# EAGLE design test1 (EAGLE 6.6.0)
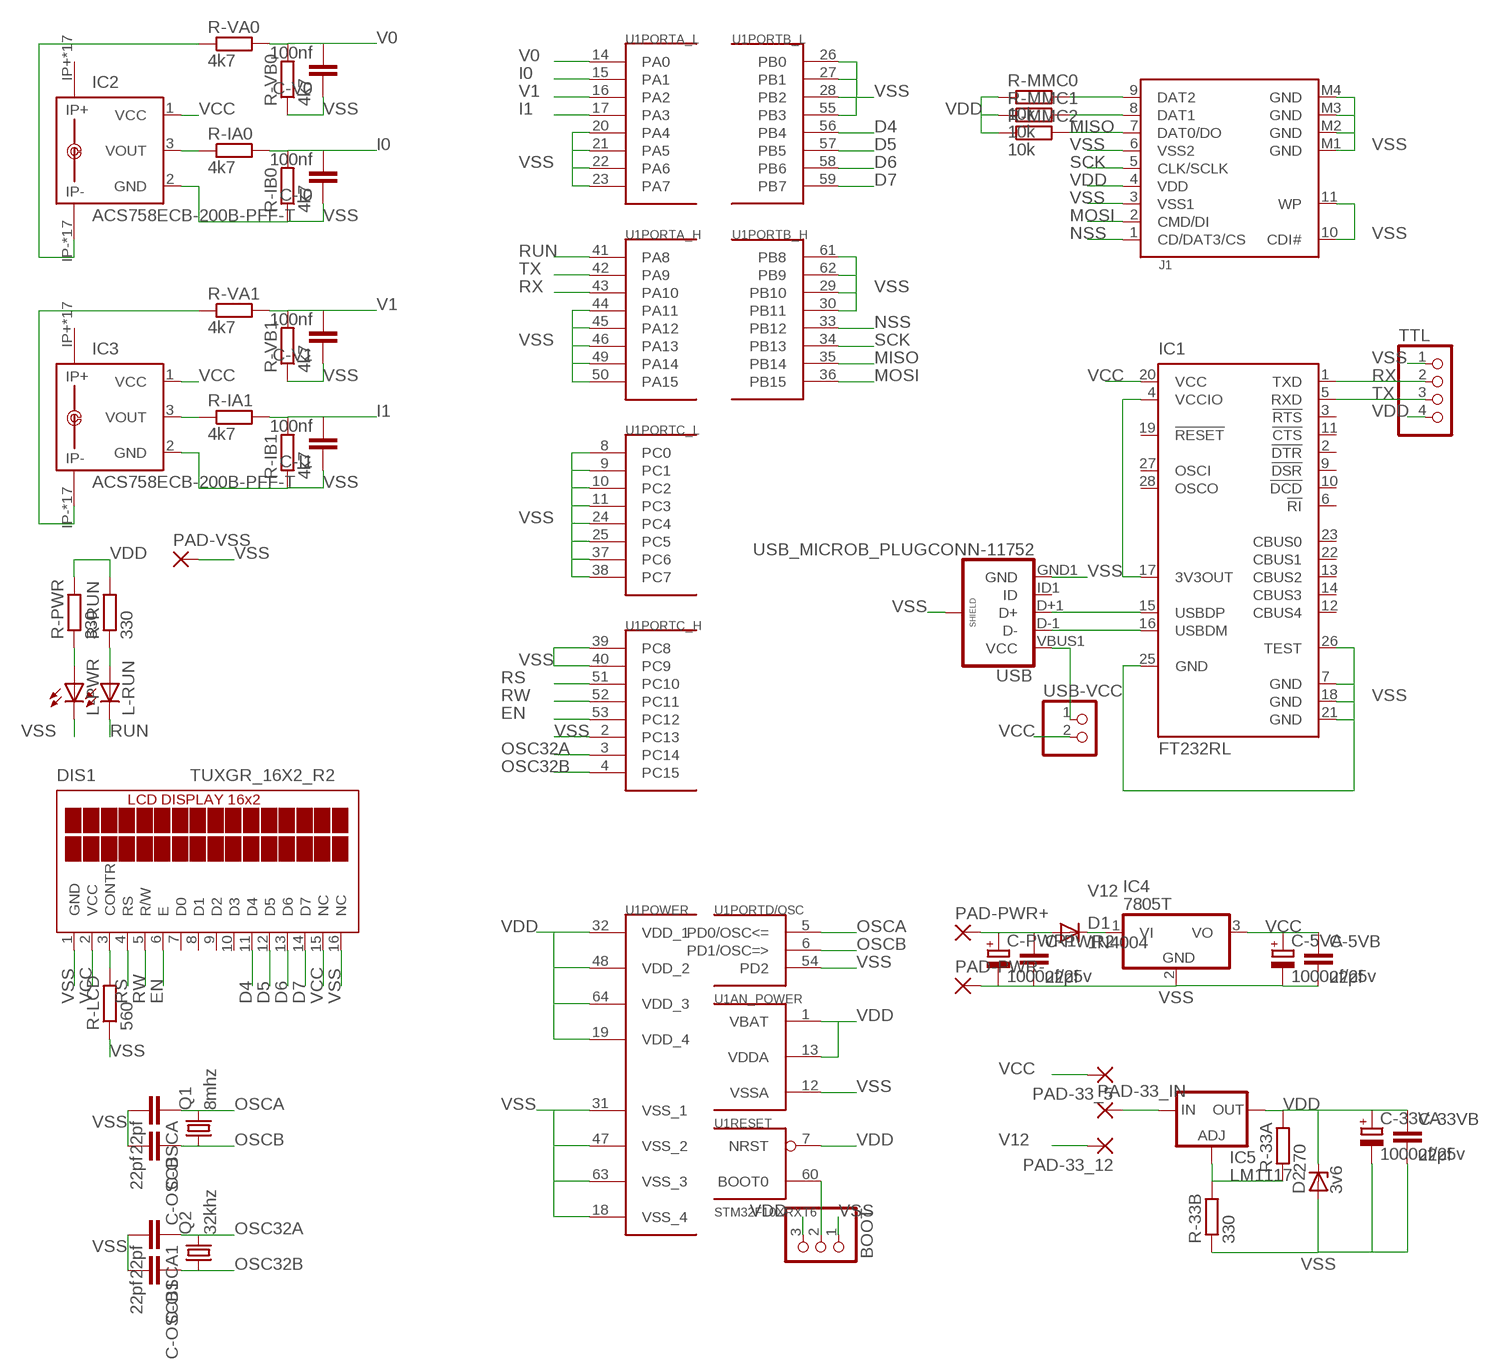
[diagram p0: schematic, sheet 1]

## Parts
BOOT  PINHD-1X3  [1X03]
C-5VA  1000uf/25v  CPOL-EUE2-5  [E2-5]
C-5VB  22pf  C-EUC1206  [C1206]
C-33VA  1000uf/25v  CPOL-EUE2-5  [E2-5]
C-33VB  22pf  C-EUC1206  [C1206]
C-I0  100nf  C-EUC1206  [C1206]
C-I1  100nf  C-EUC1206  [C1206]
C-OSCA  22pf  C-EUC1206  [C1206]
C-OSCA1  22pf  C-EUC1206  [C1206]
C-OSCB  22pf  C-EUC1206  [C1206]
C-OSCB1  22pf  C-EUC1206  [C1206]
C-PWR1  1000uf/25v  CPOL-EUE2-5  [E2-5]
C-PWR2  22pf  C-EUC1206  [C1206]
C-V0  100nf  C-EUC1206  [C1206]
C-V1  100nf  C-EUC1206  [C1206]
D1  1N4004  [DO41-10]
D2  3v6  ZENER-DIODESMB  [SMB]
DIS1  TUXGR_16X2_R2  [TUXGR_16X2_R2]
IC1  FT232RL  [SSOP28]
IC2  ACS758ECB-200B-PFF-T  [CB-PFF]
IC3  ACS758ECB-200B-PFF-T  [CB-PFF]
IC4  7805T  [TO220H]
IC5  LM1117  LM317TL  [317TL]
J1  SDCARD  [SDCMF-10915W010]
L-PWR  LEDSML1206  [SML1206]
L-RUN  LEDSML1206  [SML1206]
PAD-33_5  3,81/1,4  [3,81/1,4]
PAD-33_12  3,81/1,4  [3,81/1,4]
PAD-33_IN  3,81/1,4  [3,81/1,4]
PAD-PWR+  3,81/1,4  [3,81/1,4]
PAD-PWR-  3,81/1,4  [3,81/1,4]
PAD-VSS  3,81/1,4  [3,81/1,4]
Q1  8mhz  CRYSTALHC49S  [HC49/S]
Q2  32khz  CRYSTALTC26V  [TC26V]
R-33A  270  R-EU_R1206  [R1206]
R-33B  330  R-EU_R1206  [R1206]
R-IA0  4k7  R-EU_R1206  [R1206]
R-IA1  4k7  R-EU_R1206  [R1206]
R-IB0  4k7  R-EU_R1206  [R1206]
R-IB1  4k7  R-EU_R1206  [R1206]
R-LCD  560  R-EU_R1206  [R1206]
R-MMC0  10k  R-EU_R1206  [R1206]
R-MMC1  10k  R-EU_R1206  [R1206]
R-MMC2  10k  R-EU_R1206  [R1206]
R-PWR  330  R-EU_R1206  [R1206]
R-RUN  330  R-EU_R1206  [R1206]
R-VA0  4k7  R-EU_R1206  [R1206]
R-VA1  4k7  R-EU_R1206  [R1206]
R-VB0  4k7  R-EU_R1206  [R1206]
R-VB1  4k7  R-EU_R1206  [R1206]
TTL  PINHD-1X4  [1X04]
U1  STM32F10XRXT6  [TQFP64]
USB  USB_MICROB_PLUGCONN-11752  [USB-B-MICRO-SMD_V03]
USB-VCC  PINHD-1X2  [1X02]

## Nets
D4: DIS1.11(D4) U1.56(PORTB_L:PB4)
D5: DIS1.12(D5) U1.57(PORTB_L:PB5)
D6: DIS1.13(D6) U1.58(PORTB_L:PB6)
D7: DIS1.14(D7) U1.59(PORTB_L:PB7)
EN: DIS1.6(E) U1.53(PORTC_H:PC12)
I0: C-I0.2 R-IA0.2 R-IB0.2 U1.15(PORTA_L:PA1)
I1: C-I1.2 R-IA1.2 R-IB1.2 U1.17(PORTA_L:PA3)
MISO: J1.7(DAT0/DO) R-MMC2.2 U1.35(PORTB_H:PB14)
MOSI: J1.2(CMD/DI) U1.36(PORTB_H:PB15)
N$1: IC1.16(USBDM) USB.D-1(D-)
N$2: IC1.15(USBDP) USB.D+1(D+)
N$3: IC2.3(VOUT) R-IA0.1
N$4: IC2.IP- IC2.IP-@2(IP-) IC2.IP-@3(IP-) IC2.IP-@4(IP-) IC2.IP-@5(IP-) IC2.IP-@6(IP-) IC2.IP-@7(IP-) IC2.IP-@8(IP-) IC2.IP-@9(IP-) IC2.IP-@10(IP-) IC2.IP-@11(IP-) IC2.IP-@12(IP-) IC2.IP-@13(IP-) IC2.IP-@14(IP-) IC2.IP-@15(IP-) IC2.IP-@16(IP-) IC2.IP-@17(IP-) R-VA0.1
N$5: USB-VCC.1 USB.VBUS1(VCC)
N$6: IC3.3(VOUT) R-IA1.1
N$7: IC3.IP- IC3.IP-@2(IP-) IC3.IP-@3(IP-) IC3.IP-@4(IP-) IC3.IP-@5(IP-) IC3.IP-@6(IP-) IC3.IP-@7(IP-) IC3.IP-@8(IP-) IC3.IP-@9(IP-) IC3.IP-@10(IP-) IC3.IP-@11(IP-) IC3.IP-@12(IP-) IC3.IP-@13(IP-) IC3.IP-@14(IP-) IC3.IP-@15(IP-) IC3.IP-@16(IP-) IC3.IP-@17(IP-) R-VA1.1
N$8: DIS1.3(CONTR) R-LCD.2
N$9: L-PWR.A R-PWR.1
N$10: L-RUN.A R-RUN.1
N$11: C-PWR1.+ C-PWR2.1 D1.A PAD-PWR+.1(P)
N$12: IC5.3(IN) PAD-33_IN.1(P)
N$15: IC5.1(ADJ) R-33A.1 R-33B.2
N$16: BOOT.2 U1.60(RESET:BOOT0)
N$18: J1.8(DAT1) R-MMC1.2
N$19: J1.9(DAT2) R-MMC0.2
NSS: J1.1(CD/DAT3/CS) U1.33(PORTB_H:PB12)
OSC32A: C-OSCA1.1 Q2.2 U1.3(PORTC_H:PC14)
OSC32B: C-OSCB1.1 Q2.1 U1.4(PORTC_H:PC15)
OSCA: C-OSCA.1 Q1.2 U1.5(PORTD/OSC:PD0/OSC<=)
OSCB: C-OSCB.1 Q1.1 U1.6(PORTD/OSC:PD1/OSC=>)
RS: DIS1.4(RS) U1.51(PORTC_H:PC10)
RUN: L-RUN.C U1.41(PORTA_H:PA8)
RW: DIS1.5(R/W) U1.52(PORTC_H:PC11)
RX: IC1.1(TXD) TTL.2 U1.43(PORTA_H:PA10)
SCK: J1.5(CLK/SCLK) U1.34(PORTB_H:PB13)
TX: IC1.5(RXD) TTL.3 U1.42(PORTA_H:PA9)
V0: C-V0.2 R-VA0.2 R-VB0.2 U1.14(PORTA_L:PA0)
V1: C-V1.2 R-VA1.2 R-VB1.2 U1.16(PORTA_L:PA2)
V12: D1.C IC4.1(VI) PAD-33_12.1(P)
VCC: C-5VA.+ C-5VB.1 DIS1.2(VCC) DIS1.15(NC) IC1.20(VCC) IC2.1(VCC) IC3.1(VCC) IC4.3(VO) PAD-33_5.1(P) USB-VCC.2
VDD: BOOT.3 C-33VA.+ C-33VB.1 D2.C IC1.4(VCCIO) IC1.17(3V3OUT) IC5.2(OUT) J1.4(VDD) R-33A.2 R-MMC0.1 R-MMC1.1 R-MMC2.1 R-PWR.2 R-RUN.2 TTL.4 U1.1(AN_POWER:VBAT) U1.7(RESET:NRST) U1.13(AN_POWER:VDDA) U1.19(POWER:VDD_4) U1.32(POWER:VDD_1) U1.48(POWER:VDD_2) U1.64(POWER:VDD_3)
VSS: BOOT.1 C-5VA.- C-5VB.2 C-33VA.- C-33VB.2 C-I0.1 C-I1.1 C-OSCA1.2 C-OSCA.2 C-OSCB1.2 C-OSCB.2 C-PWR1.- C-PWR2.2 C-V0.1 C-V1.1 D2.A DIS1.1(GND) DIS1.16(NC) IC1.7(GND) IC1.18(GND) IC1.21(GND) IC1.25(GND) IC1.26(TEST) IC2.2(GND) IC3.2(GND) IC4.2(GND) J1.3(VSS1) J1.6(VSS2) J1.10(CDI#) J1.11(WP) J1.M1(GND) J1.M2(GND) J1.M3(GND) J1.M4(GND) L-PWR.C PAD-PWR-.1(P) PAD-VSS.1(P) R-33B.1 R-IB0.1 R-IB1.1 R-LCD.1 R-VB0.1 R-VB1.1 TTL.1 U1.2(PORTC_H:PC13) U1.8(PORTC_L:PC0) U1.9(PORTC_L:PC1) U1.10(PORTC_L:PC2) U1.11(PORTC_L:PC3) U1.12(AN_POWER:VSSA) U1.18(POWER:VSS_4) U1.20(PORTA_L:PA4) U1.21(PORTA_L:PA5) U1.22(PORTA_L:PA6) U1.23(PORTA_L:PA7) U1.24(PORTC_L:PC4) U1.25(PORTC_L:PC5) U1.26(PORTB_L:PB0) U1.27(PORTB_L:PB1) U1.28(PORTB_L:PB2) U1.29(PORTB_H:PB10) U1.30(PORTB_H:PB11) U1.31(POWER:VSS_1) U1.37(PORTC_L:PC6) U1.38(PORTC_L:PC7) U1.39(PORTC_H:PC8) U1.40(PORTC_H:PC9) U1.44(PORTA_H:PA11) U1.45(PORTA_H:PA12) U1.46(PORTA_H:PA13) U1.47(POWER:VSS_2) U1.49(PORTA_H:PA14) U1.50(PORTA_H:PA15) U1.54(PORTD/OSC:PD2) U1.55(PORTB_L:PB3) U1.61(PORTB_H:PB8) U1.62(PORTB_H:PB9) U1.63(POWER:VSS_3) USB.GND1(GND) USB.SHIELD1(SHIELD) USB.SHIELD2(SHIELD) USB.SHIELD3(SHIELD)
Unconnected: DIS1.7(D0) DIS1.8(D1) DIS1.9(D2) DIS1.10(D3) IC1.2(!DTR) IC1.3(!RTS) IC1.6(!RI) IC1.9(!DSR) IC1.10(!DCD) IC1.11(!CTS) IC1.12(CBUS4) IC1.13(CBUS2) IC1.14(CBUS3) IC1.19(!RESET) IC1.22(CBUS1) IC1.23(CBUS0) IC1.27(OSCI) IC1.28(OSCO) IC2.IP+ IC2.IP+@2(IP+) IC2.IP+@3(IP+) IC2.IP+@4(IP+) IC2.IP+@5(IP+) IC2.IP+@6(IP+) IC2.IP+@7(IP+) IC2.IP+@8(IP+) IC2.IP+@9(IP+) IC2.IP+@10(IP+) IC2.IP+@11(IP+) IC2.IP+@12(IP+) IC2.IP+@13(IP+) IC2.IP+@14(IP+) IC2.IP+@15(IP+) IC2.IP+@16(IP+) IC2.IP+@17(IP+) IC3.IP+ IC3.IP+@2(IP+) IC3.IP+@3(IP+) IC3.IP+@4(IP+) IC3.IP+@5(IP+) IC3.IP+@6(IP+) IC3.IP+@7(IP+) IC3.IP+@8(IP+) IC3.IP+@9(IP+) IC3.IP+@10(IP+) IC3.IP+@11(IP+) IC3.IP+@12(IP+) IC3.IP+@13(IP+) IC3.IP+@14(IP+) IC3.IP+@15(IP+) IC3.IP+@16(IP+) IC3.IP+@17(IP+) USB.ID1(ID)

## Library data of the parts
BOOT = pinhead:PINHD-1X3: PIN HEADER
C-5VA C-33VA C-PWR1 = resistor:CPOL-EU: POLARIZED CAPACITOR, European symbol
C-5VB C-33VB C-I0 C-I1 C-OSCA C-OSCA1 C-OSCB C-OSCB1 C-PWR2 C-V0 C-V1 = resistor:C-EU: CAPACITOR, European symbol
D1 = diode:1N4004: DIODE general purpose rectifier, 1 A
D2 = diode:ZENER-DIODE: Z-Diode
DIS1 = display-lcd:TUXGR_16X2_R2: Tuxgraphics LCD display 16x2 characters reflective, without background light Source: tuxgr_12x2_r2.pdf; OC_FARNELL: unknown; OC_NEWARK: unknown
IC1 = ftdichip:FT232R: Source: http://www.ftdichip.com/Documents/DataSheets/DS_FT232R_v104.pdf; MPN: FT232RL; OC_FARNELL: 1146032; OC_NEWARK: 91K9918
IC2 IC3 = allegro:ACS758*: Thermally Enhanced, Fully Integrated, Hall Effect-Based Linear Current Sensor with 100 micro Ohm Current Conductor display layer 49 Reference in BRD and place VIAs on circles Source: http://www.allegromicro.com/en/Products/Part_Numbers/0758/0758.pdf; MPN: ACS758ECB-200B-PFF-T; OC_FARNELL: 1718993; OC_NEWARK: 04R7127
IC4 = linear:78*: Positive VOLTAGE REGULATOR Source: http://cache.national.com/ds/LM/LM78L05.pdf http://www.fairchildsemi.com/ds/LM/LM7805.pdf
IC5 = v-reg:LM317TL: VOLTAGE REGULATOR
J1 = sd-mmc:SDCARD: SD card connector KINGFONT SDCMF-10915W010
L-PWR L-RUN = led:LED: LED OSRAM: - CHIPLED LG R971, LG N971, LY N971, LG Q971, LY Q971, LO R971, LY R971 LH N974, LH R974 LS Q976, LO Q976, LY Q976 LO Q996 - Hyper CHIPLED LW Q18S LB Q993, LB Q99A, LB R99A - SideLED LS A670, LO A670, LY A670, LG A670, LP A670 LB A673, LV A673, LT A673, LW A673 LH A674 LY A675 LS A676, LA A676, LO A676, LY A676, LW A676 LS A679, LY A679, LG A679 - Hyper Micro SIDELED® LS Y876, LA Y876, LO Y876, LY Y876 LT Y87S - SmartLED LW L88C, LW L88S LB L89C, LB L89S, LG L890 LS L89K, LO L89K, LY L89K LS L896, LA L896, LO L896, LY L896 - TOPLED LS T670, LO T670, LY T670, LG T670, LP T670 LSG T670, LSP T670, LSY T670, LOP T670, LYG T670 LG T671, LOG T671, LSG T671 LB T673, LV T673, LT T673, LW T673 LH T674 LS T676, LA T676, LO T676, LY T676, LB T676, LH T676, LSB T676, LW T676 LB T67C, LV T67C, LT T67C, LS T67K, LO T67K, LY T67K, LW E67C LS E67B, LA E67B, LO E67B, LY E67B, LB E67C, LV E67C, LT E67C LW T67C LS T679, LY T679, LG T679 LS T770, LO T770, LY T770, LG T770, LP T770 LB T773, LV T773, LT T773, LW T773 LH T774 LS E675, LA E675, LY E675, LS T675 LS T776, LA T776, LO T776, LY T776, LB T776 LHGB T686 LT T68C, LB T68C - Hyper Mini TOPLED® LB M676 - Mini TOPLED Santana® LG M470 LS M47K, LO M47K, LY M47K Source: http://www.osram.convergy.de LUXEON: - LUMILED® LXK2-PW12-R00, LXK2-PW12-S00, LXK2-PW14-U00, LXK2-PW14-V00 LXK2-PM12-R00, LXK2-PM12-S00, LXK2-PM14-U00 LXK2-PE12-Q00, LXK2-PE12-R00, LXK2-PE12-S00, LXK2-PE14-T00, LXK2-PE14-U00 LXK2-PB12-K00, LXK2-PB12-L00, LXK2-PB12-M00, LXK2-PB14-N00, LXK2-PB14-P00, LXK2-PB14-Q00 LXK2-PR12-L00, LXK2-PR12-M00, LXK2-PR14-Q00, LXK2-PR14-R00 LXK2-PD12-Q00, LXK2-PD12-R00, LXK2-PD12-S00 LXK2-PH12-R00, LXK2-PH12-S00 LXK2-PL12-P00, LXK2-PL12-Q00, LXK2-PL12-R00 Source: www.luxeon.com KINGBRIGHT: KA-3528ASYC Source: www.kingbright.com
PAD-33_5 PAD-33_12 PAD-33_IN PAD-PWR+ PAD-PWR- PAD-VSS = wirepad:3,81/1,4: THROUGH-HOLE PAD
Q1 = crystal:CRYSTAL: CRYSTAL; OC_FARNELL: 1667008; OC_NEWARK: unknown
Q2 = crystal:CRYSTAL: CRYSTAL; OC_FARNELL: unknown; OC_NEWARK: unknown
R-33A R-33B R-IA0 R-IA1 R-IB0 R-IB1 R-LCD R-MMC0 R-MMC1 R-MMC2 R-PWR R-RUN R-VA0 R-VA1 R-VB0 R-VB1 = resistor:R-EU_: RESISTOR, European symbol
TTL = pinhead:PINHD-1X4: PIN HEADER
U1 = stm32:STM32F10XRXT6: STM32F101/103 64pin LQFP
USB = SparkFun-Connectors:USB_MICROB_PLUG: USB Micro-B connectors Some male, some female. Watch your step!; PROD_ID: CONN-11752
USB-VCC = pinhead:PINHD-1X2: PIN HEADER

## Board
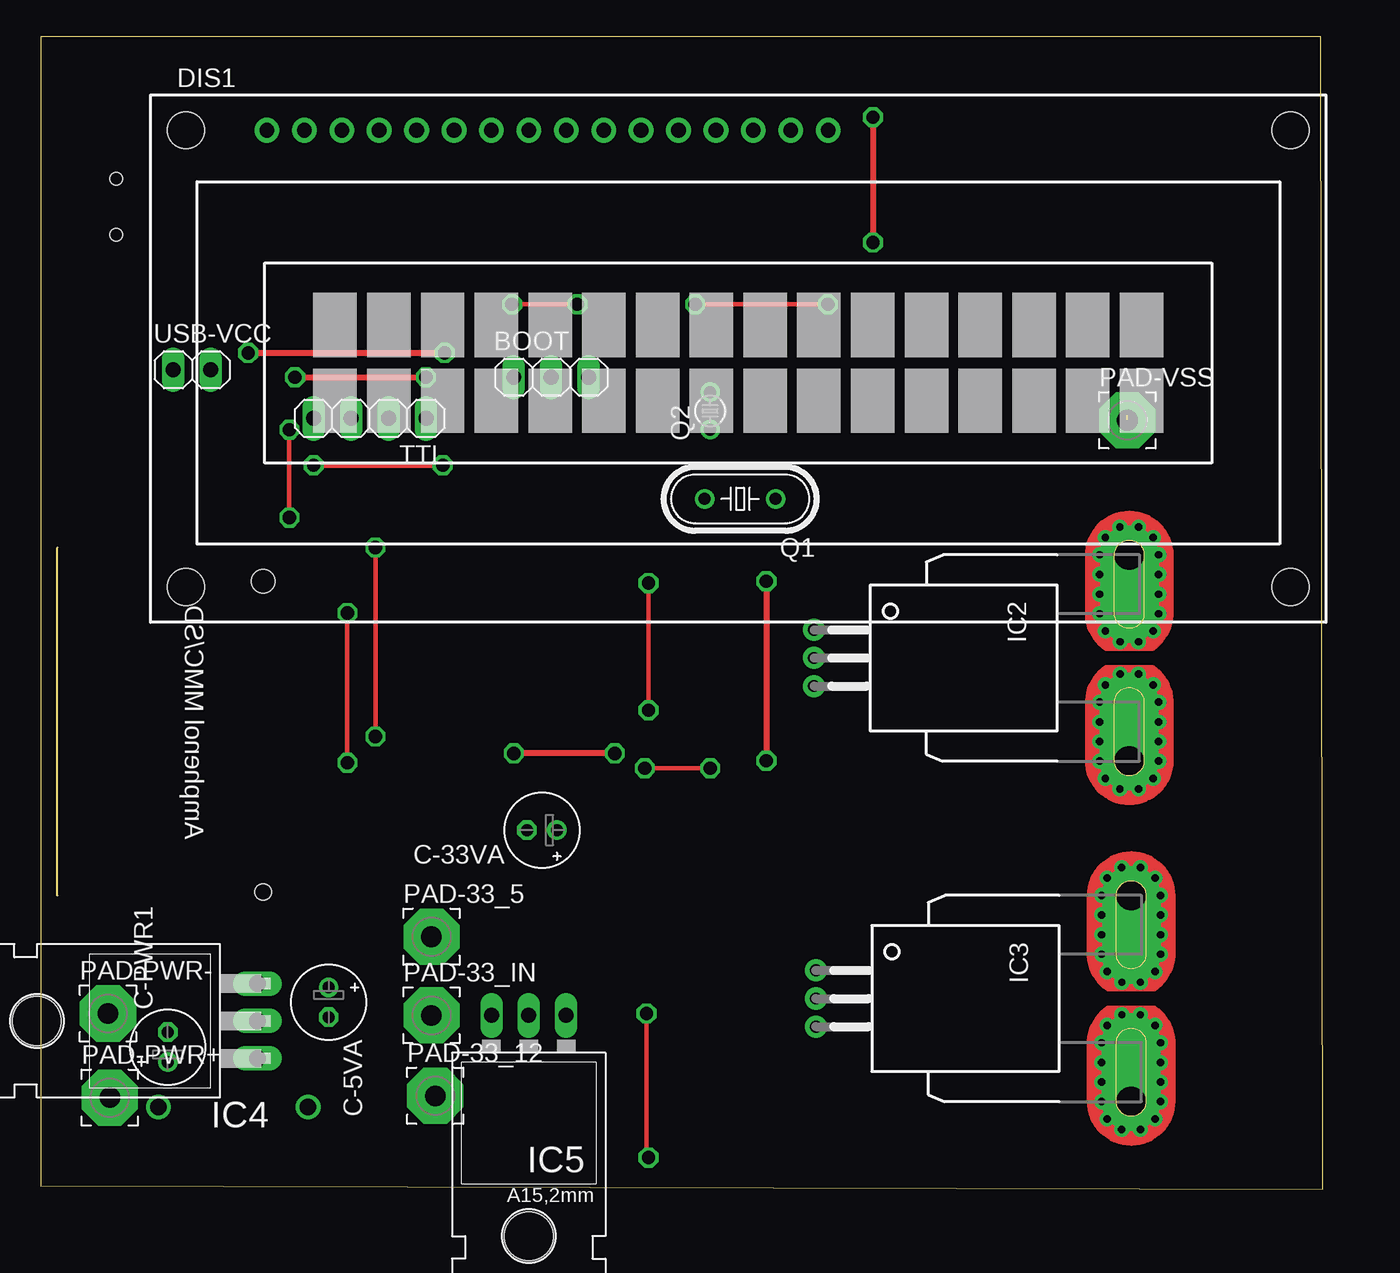
[diagram p1: board, top side]
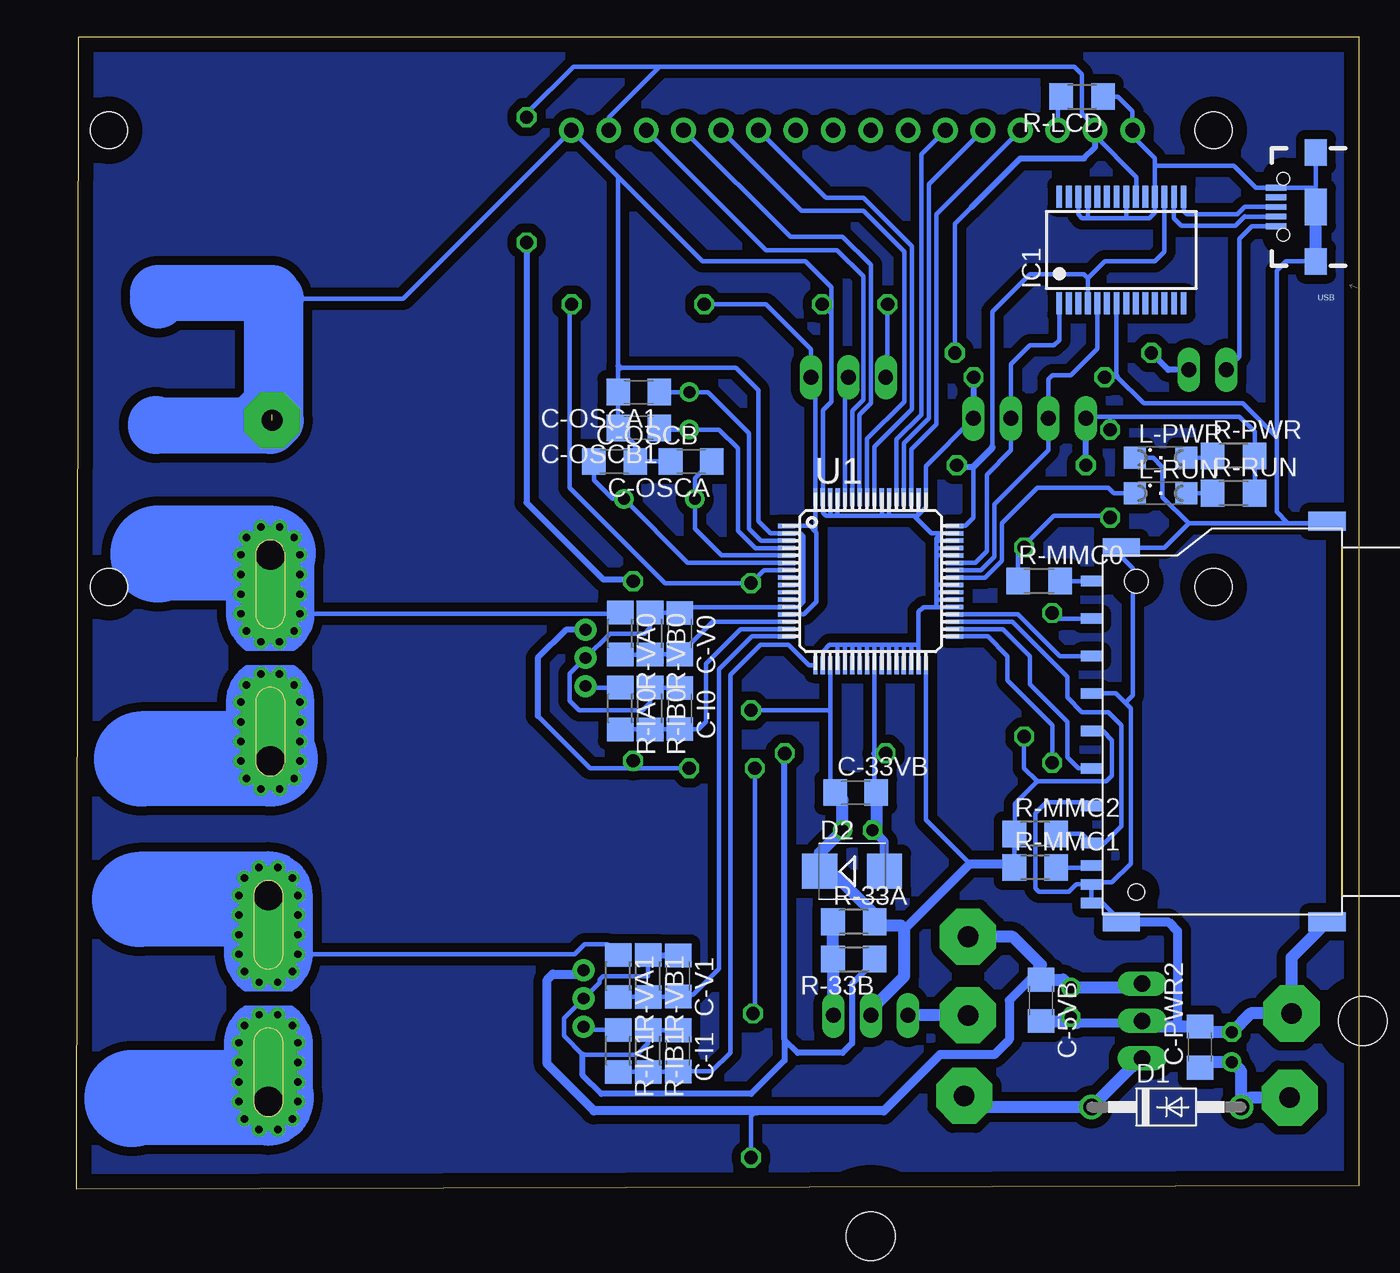
[diagram p2: board, bottom side, seen from below]

Size 87.05 x 78.22 mm. Coordinates in mm from the lower left corner, seen from the top.
Outline: 0,0.25 87.05,0 86.92,78.22 0,78.22 0,0.25
Copper layers (1*16): Top 0.035mm / dielectric 1.5mm / Bottom 0.035mm
Design rules "default": minimum track width 10mil, minimum drill 24mil, track to track 8mil, track to pad 8mil, pad to pad 8mil, via to via 8mil, smd to smd 8mil, copper to edge 40mil, drill to drill 8mil, minimum pad ring 10mil, minimum via ring 8mil, stop-mask expansion 4mil, vias tented up to drill 0mil, thermal gap 10mil

### Footprints (pad centres in the part's own frame; a part is rotated, then mirrored left to right if it is on the bottom)
1X03 = drill 1.016 long: 1 -2.54,0; 2 0,0; 3 2.54,0
E2-5 = drill 0.813 pad 1.27: + -1.016,0 | drill 0.813 pad 1.27 octagon: - 1.016,0
C1206 = smd 1.6 x 1.8: 1 -1.4,0; 2 1.4,0
DO41-10 = drill 1.118: A 5.08,0; C -5.08,0
SMB = smd 2.4 x 2.4: A 2.2,0; C -2.2,0
TUXGR_16X2_R2 = drill 1 pad 1.676: 1 -32,15.5; 2 -29.46,15.5; 3 -26.92,15.5; 4 -24.38,15.5; 5 -21.84,15.5; 6 -19.3,15.5; 7 -16.76,15.5; 8 -14.22,15.5; 9 -11.68,15.5; 10 -9.14,15.5; 11 -6.6,15.5; 12 -4.06,15.5; 13 -1.52,15.5; 14 1.02,15.5; 15 3.56,15.5; 16 6.1,15.5 | hole 2.5: -37.5,-15.5; 37.5,-15.5; -37.5,15.5; 37.5,15.5
SSOP28 = smd 0.4 x 1.5: 1 -4.225,-3.625; 2 -3.575,-3.625; 3 -2.925,-3.625; 4 -2.275,-3.625; 5 -1.625,-3.625; 6 -0.975,-3.625; 7 -0.325,-3.625; 8 0.325,-3.625; 9 0.975,-3.625; 10 1.625,-3.625; 11 2.275,-3.625; 12 2.925,-3.625; 13 3.575,-3.625; 14 4.225,-3.625; 15 4.225,3.625; 16 3.575,3.625; 17 2.925,3.625; 18 2.275,3.625; 19 1.625,3.625; 20 0.975,3.625; 21 0.325,3.625; 22 -0.325,3.625; 23 -0.975,3.625; 24 -1.625,3.625; 25 -2.275,3.625; 26 -2.925,3.625; 27 -3.575,3.625; 28 -4.225,3.625
CB-PFF = drill 0.8 pad 1.5: 1 -1.91,-21.4; 2 0,-21.4; 3 1.91,-21.4 | drill 2 pad 4 offset: IP+ 7,0; IP- -7,0 | drill 0.5 pad 0.9: IP+@2 8.89,0.635; IP+@3 8.89,-0.635; IP+@4 8.175,-1.625; IP+@5 7,-2; IP+@6 5.675,-2; IP+@7 4.35,-2; IP+@8 3,-2; IP+@9 1.825,-1.625; IP+@10 1.1,-0.625; IP+@11 1.1,0.625; IP+@12 1.825,1.625; IP+@13 3,2; IP+@14 4.35,2; IP+@15 5.675,2; IP+@16 7,2; IP+@17 8.175,1.625; IP-@2 -8.89,0.635; IP-@3 -8.89,-0.635; IP-@4 -8.175,-1.625; IP-@5 -7,-2; IP-@6 -5.675,-2; IP-@7 -4.325,-2; IP-@8 -3,-2; IP-@9 -1.825,-1.625; IP-@10 -1.1,-0.625; IP-@11 -1.1,0.625; IP-@12 -1.825,1.625; IP-@13 -3,2; IP-@14 -4.325,2; IP-@15 -5.675,2; IP-@16 -7,2; IP-@17 -8.175,1.625
TO220H = drill 1.118 long: 1 -2.54,-10.16; 2 0,-10.16; 3 2.54,-10.16 | hole 3.302: 0,4.826
317TL = drill 1.016 long: 1 -2.54,-3.81; 2 0,-3.81; 3 2.54,-3.81 | hole 3.302: 0,11.176
SDCMF-10915W010 = smd 0.711 x 1.422: 1 7.366,13.462; 2 4.826,13.462; 3 2.286,13.462; 4 -0.254,13.462; 5 -2.794,13.462; 6 -5.334,13.462; 7 -7.874,13.462; 8 -9.398,13.462; 9 9.906,13.462; 10 -11.938,13.462; 11 -10.668,13.462 | smd 1.27 x 2.54: M1 12.192,11.43; M2 13.97,-2.54; M3 -13.208,-2.54; M4 -13.208,11.43 | hole 1.6: 9.906,10.414 | hole 1.1: -11.176,10.414
SML1206 = smd 1.5 x 1.5: A 1.75,0; C -1.75,0
3,81/1,4 = drill 1.397 pad 3.81 octagon: 1 0,0
HC49/S = drill 0.813: 1 -2.413,0; 2 2.413,0
TC26V = drill 0.813: 1 -1.27,0; 2 1.27,0
R1206 = smd 1.6 x 1.803: 1 -1.422,0; 2 1.422,0
1X04 = drill 1.016 long: 1 -3.81,0; 2 -1.27,0; 3 1.27,0; 4 3.81,0
TQFP64 = smd 1.2 x 0.3: 1 -5.7,3.75; 2 -5.7,3.25; 3 -5.7,2.75; 4 -5.7,2.25; 5 -5.7,1.75; 6 -5.7,1.25; 7 -5.7,0.75; 8 -5.7,0.25; 9 -5.7,-0.25; 10 -5.7,-0.75; 11 -5.7,-1.25; 12 -5.7,-1.75; 13 -5.7,-2.25; 14 -5.7,-2.75; 15 -5.7,-3.25; 16 -5.7,-3.75; 33 5.7,-3.75; 34 5.7,-3.25; 35 5.7,-2.75; 36 5.7,-2.25; 37 5.7,-1.75; 38 5.7,-1.25; 39 5.7,-0.75; 40 5.7,-0.25; 41 5.7,0.25; 42 5.7,0.75; 43 5.7,1.25; 44 5.7,1.75; 45 5.7,2.25; 46 5.7,2.75; 47 5.7,3.25; 48 5.7,3.75 | smd 0.3 x 1.2: 17 -3.75,-5.7; 18 -3.25,-5.7; 19 -2.75,-5.7; 20 -2.25,-5.7; 21 -1.75,-5.7; 22 -1.25,-5.7; 23 -0.75,-5.7; 24 -0.25,-5.7; 25 0.25,-5.7; 26 0.75,-5.7; 27 1.25,-5.7; 28 1.75,-5.7; 29 2.25,-5.7; 30 2.75,-5.7; 31 3.25,-5.7; 32 3.75,-5.7; 49 3.75,5.7; 50 3.25,5.7; 51 2.75,5.7; 52 2.25,5.7; 53 1.75,5.7; 54 1.25,5.7; 55 0.75,5.7; 56 0.25,5.7; 57 -0.25,5.7; 58 -0.75,5.7; 59 -1.25,5.7; 60 -1.75,5.7; 61 -2.25,5.7; 62 -2.75,5.7; 63 -3.25,5.7; 64 -3.75,5.7
USB-B-MICRO-SMD_V03 = smd 1.4 x 0.4: D+1 2.7,0; D-1 2.7,0.65; GND1 2.7,-1.3; ID1 2.7,-0.65; VBUS1 2.7,1.3 | smd 1.5 x 1.8: SHIELD1 0,3.7; SHIELD2 0,-3.7 | smd 1.5 x 2.5: SHIELD3 0,0 | hole 0.85: 2.2,1.9; 2.2,-1.9
1X02 = drill 1.016 long: 1 -1.27,0; 2 1.27,0

### Placement (x,y rotation side)
BOOT  34.67,55.12 0 top
C-5VA  19.56,12.7 270 top
C-5VB  21.59,12.83 270 bottom
C-33VA  34.04,24.38 180 top
C-33VB  34.16,26.92 0 bottom
C-I0  46.1,32.64 270 bottom
C-I1  46.23,9.4 270 bottom
C-OSCA  45.34,49.4 180 bottom
C-OSCA1  48.89,54.1 180 bottom
C-OSCB  50.55,49.4 0 bottom
C-OSCB1  48.89,51.69 180 bottom
C-PWR1  8.64,9.65 90 top
C-PWR2  10.79,9.65 90 bottom
C-V0  46.1,37.72 270 bottom
C-V1  46.23,14.48 270 bottom
D1  13.08,5.59 0 bottom
D2  34.42,21.59 0 bottom
DIS1  47.37,56.39 0 top
IC1  16.13,63.75 0 bottom
IC2  73.91,36.07 270 top
IC3  74.04,12.95 270 top
IC4  4.57,11.43 90 top
IC5  33.15,8 180 top
J1  4.7,31.37 90 bottom
L-PWR  13.46,49.66 0 bottom
L-RUN  13.46,47.24 0 bottom
PAD-33_5  26.54,17.14 0 top
PAD-33_12  26.8,6.35 0 top
PAD-33_IN  26.54,11.81 0 top
PAD-PWR+  4.7,6.22 0 top
PAD-PWR-  4.57,11.94 0 top
PAD-VSS  73.79,52.2 0 top
Q1  47.5,46.86 180 top
Q2  45.47,52.83 90 top
R-33A  34.29,18.16 0 bottom
R-33B  34.29,15.62 180 bottom
R-IA0  50.16,32.64 270 bottom
R-IA1  50.29,9.4 270 bottom
R-IB0  48.13,32.64 270 bottom
R-IB1  48.26,9.4 270 bottom
R-LCD  18.8,74.17 180 bottom
R-MMC0  21.72,41.27 0 bottom
R-MMC1  21.97,21.84 0 bottom
R-MMC2  21.97,24.13 0 bottom
R-PWR  8.51,49.78 0 bottom
R-RUN  8.51,47.24 0 bottom
R-VA0  50.16,37.72 270 bottom
R-VA1  50.29,14.48 270 bottom
R-VB0  48.13,37.72 270 bottom
R-VB1  48.26,14.48 270 bottom
TTL  22.35,52.32 180 top
U1  33.15,41.27 0 bottom
USB  2.92,66.67 180 bottom
USB-VCC  10.29,55.63 0 top

### Tracks (layer width: path | path; a pad name or v marks a point on that pad's centre or on a via)
D4
  Bottom 0.305: U1.56 32.9,50.41 30.35,52.96 30.35,64.01 33.66,67.31 36.19,67.31 DIS1.11
D5
  Bottom 0.305: U1.57 33.4,50.93 30.86,53.47 30.86,63.63 33.66,66.42 37.84,66.42 DIS1.12
D6
  Bottom 0.305: U1.58 33.9,52.59 33.15,53.34 33.15,62.74 35.05,64.64 38.61,64.64 DIS1.13
D7
  Bottom 0.305: U1.59 34.4,52.85 33.66,53.59 33.66,61.98 35.43,63.75 40.26,63.75 DIS1.14
EN
  Bottom 0.305: U1.53 31.4,50.9 29.72,52.58 29.72,70.24 DIS1.6
I0
  Bottom 0.305: U1.15 41.98,38.02 44.32,35.69 44.32,31.75 44.83,31.24 C-I0.2 48.11,31.24 R-IB0.2 R-IA0.2
I1
  Bottom 0.305: U1.17 37.35,35.58 38.73,36.96 40.64,36.96 42.67,34.92 42.67,9.27 43.94,8 C-I1.2 48.24,8 R-IB1.2 R-IA1.2
MISO
  Bottom 0.305: R-MMC2.2 18.8,24.13 J1.7 17.27,23.5 16.13,24.64 16.13,31.5 17.02,32.38 18.8,32.38 19.81,33.4 19.81,34.8 23.54,38.52 U1.35
MOSI
  Bottom 0.305: U1.36 23.15,39.02 20.32,36.2 J1.2
N$1
  Bottom 0.305: IC1.16 12.55,65.89 12.06,65.41 8.38,65.41 7.75,66.04 7.73,66.03 USB.D-1
N$2
  Bottom 0.305: IC1.15 11.9,66.39 11.68,66.17 8.25,66.17 7.75,66.67 USB.D+1
N$3
  Bottom 0.305: R-IA0.1 52.42,34.06 IC2.3
N$4
  Bottom 0.305: IC2.IP-@8 50.24,39.07 R-VA0.1
N$5
  Bottom 0.305: USB.VBUS1 7.27,65.38 8.13,64.52 8.13,56.52 USB-VCC.1
N$6
  Bottom 0.305: R-IA1.1 52.42,10.82 IC3.3
N$7
  Bottom 0.305: IC3.IP-@8 53.26,15.95 52.58,16.64 51.03,16.64 R-VA1.1
N$8
  Bottom 0.305: DIS1.3 20.45,73.94 R-LCD.2
N$9
  Bottom 0.305: L-PWR.A 10.06,49.66 R-PWR.1
N$10
  Bottom 0.305: L-RUN.A R-RUN.1
N$11
  Bottom 0.813: PAD-PWR+.1 7.37,6.22 D1.A 8,8 C-PWR1.+ 10.41,8.64 C-PWR2.1
N$12
  Bottom 0.813: PAD-33_IN.1 IC5.3
N$13
  Bottom 6.452: 74.04,43.18 81.53,43.18 81.53,43.05
N$14
  Bottom 6.452: 73.91,29.21 82.68,29.21
N$15
  Bottom 0.813: IC5.1 35.69,15.6 R-33B.2 R-33A.1
N$16
  Bottom 0.305: U1.60 34.9,54.89 BOOT.2
N$17
  Bottom 6.452: 74.3,19.68 82.8,19.68
N$18
  Bottom 0.305: R-MMC1.2 18.29,21.84 J1.8
N$19
  Bottom 0.305: R-MMC0.2 J1.9
N$20
  Bottom 6.452: 74.17,6.22 83.31,6.22 83.31,6.1
N$21
  pour Bottom (isolate 0.61): 0.13,78.23 87.25,78.23 87.25,-0.38 0.13,-0.38
NSS  (via drill 0.9)
  Top 0.305: v20.83,39.12 v20.83,28.96
  Bottom 0.305: J1.1 20.45,38.73 v20.83,39.12 | v20.83,28.96 20.83,31.5 23.88,34.54 23.88,36.2 25.21,37.52 U1.33
OSC32A
  Bottom 0.305: U1.3 40.6,44.02 41.4,44.83 41.4,51.31 44.2,54.1 Q2.2 C-OSCA1.1
OSC32B
  Bottom 0.305: U1.4 40.98,43.52 42.16,44.7 42.16,50.29 43.43,51.56 Q2.1 47.37,51.56 C-OSCB1.1
OSCA
  Bottom 0.305: U1.5 43.28,43.02 45.09,44.83 Q1.2 45.09,48.26 C-OSCA.1
OSCB
  Bottom 0.305: U1.6 45.57,42.52 Q1.1 50.67,46.86 51.94,48.13 C-OSCB.1
RS
  Bottom 0.305: U1.51 30.4,50.25 28.7,51.94 28.7,66.18 DIS1.4
RUN
  Bottom 0.305: U1.41 25.4,41.52 24.26,42.67 24.26,45.21 21.84,47.62 17.02,47.62 16.64,47.24 L-RUN.C
RW
  Bottom 0.305: U1.52 30.9,50.64 29.21,52.32 29.21,68.21 DIS1.5
RX
  Bottom 0.305: U1.43 26.05,42.52 25.27,43.31 25.27,48.51 23.62,50.16 TTL.2 23.62,56.01 22.35,57.28 20.7,57.28 20.35,57.62 IC1.1
SCK
  Bottom 0.305: U1.34 24.18,38.02 22.35,36.2 22.35,34.29 19.81,31.75 19.81,29.34 19.05,28.57 J1.5
TX
  Bottom 0.305: U1.42 25.67,42.02 24.77,42.93 24.77,46.48 21.08,50.16 TTL.3 21.08,54.99 20.83,55.24 19.56,55.24 17.75,57.05 IC1.5
V0
  Bottom 0.305: U1.14 43.89,38.52 C-V0.2 48.11,36.32 R-VB0.2 R-VA0.2
V1
  Bottom 0.305: U1.16 41.21,37.52 43.43,35.31 43.43,14.99 45.21,13.21 46.1,13.21 C-V1.2 48.24,13.08 R-VB1.2 R-VA1.2
V12
  Bottom 0.813: IC4.1 15.62,8.13 D1.C 26.04,5.59 PAD-33_12.1
VCC  (via drill 0.9)
  Top 0.305: v41.15,11.94 41.15,2.29 v41.27,2.16 | v41.02,28.57 v45.47,28.57
  Top 0.406: v14.1,56.77 v27.43,56.77 | v56.52,72.77 v56.52,64.26 | v49.28,41.27 v49.28,29.08
  Bottom 0.305: 47.5,76.2 19.3,76.2 18.8,75.69 18.8,73.03 17.91,72.14 DIS1.2 17.91,71.5 15.11,68.71 15.11,67.42 IC1.20 | DIS1.15 50.93,72.77 47.5,76.2 | v27.43,56.77 27.43,65.53 26.29,66.67 | v41.02,28.57 41.02,12.06 v41.15,11.94 | v41.27,2.16 41.27,4.95 40.89,5.33 | v45.47,28.57 49.28,28.57 52.2,28.57 55.75,32.13 | v56.52,72.77 56.52,73.03 53.34,76.2 47.5,76.2
  Bottom 0.406: USB-VCC.2 12.95,55.63 v14.1,56.77 | 26.29,66.67 22.99,69.98 18.67,69.98 17.91,70.74 DIS1.2 | v56.52,64.26 56.52,46.61 51.31,41.4 49.4,41.4 v49.28,41.27 | v49.28,29.08 49.28,28.57 | IC2.1 53.84,37.98 55.75,36.07 55.75,32.13
  Bottom 0.61: 52.71,14.86 IC3.1 52.9,14.61 54.74,14.61 55.12,14.22 55.12,8.51 51.94,5.33 40.89,5.33 32.26,5.33 28.45,9.14 24.77,9.14 23.75,10.16 23.75,12.83 21.84,14.73 21.84,15.62 23.37,17.14 PAD-33_5.1
  Bottom 0.813: IC4.3 15.75,13.72 C-5VA.+ 20.07,14.23 C-5VB.1 21.59,15.24 23.5,17.14 PAD-33_5.1
VDD  (via drill 0.9)
  Top 0.305: v22.73,43.56 v22.73,30.73 | v16.89,45.59 v16.89,51.56 | v41.27,41.15 v41.27,32.51 | v53.47,60.07 v44.45,60.07
  Top 0.406: v27.3,49.15 v18.54,49.15
  Bottom 0.305: R-MMC1.1 R-MMC2.1 23.37,24.16 23.37,26.16 21.84,27.69 | U1.19 35.9,32.38 | 35.9,32.38 35.9,27.26 C-33VB.1 | J1.4 17.4,31.12 16.76,30.48 16.76,28.07 17.14,27.69 21.84,27.69 | U1.13 37.68,39.02 36.83,39.88 36.83,44.58 36.9,44.64 | 36.9,44.64 37.28,45.02 U1.1 | 36.9,44.64 U1.64 36.9,54.8 BOOT.3 37.21,57.02 40.26,60.07 v44.45,60.07 | 16.89,52.45 8.13,52.45 7.09,51.41 R-PWR.2 R-RUN.2 | 16.89,52.45 18.42,52.45 TTL.4 | U1.48 26.73,45.02 26.16,45.59 26.16,49.02 26.16,49.15 24.89,50.42 24.89,59.56 22.35,62.1 18.67,62.1 18.4,61.84 | IC1.4 18.4,61.84 | IC1.17 13.2,63.63 13.84,62.99 17.25,62.99 18.4,61.84 | U1.32 29.4,25.08 26.42,22.1 | R-MMC0.1 23.14,43.16 | 23.14,43.16 v22.73,43.56 | v22.73,30.73 22.73,28.57 21.84,27.69 | 23.14,43.16 23.14,43.28 20.7,45.72 17.02,45.72 v16.89,45.59 | v16.89,51.56 16.89,52.45 | v41.27,32.51 36.02,32.51 35.9,32.38 | U1.7 40.4,42.02 v41.27,41.15 47.12,41.15 53.59,47.62 53.59,59.94 v53.47,60.07
  Bottom 0.406: 24.89,50.42 24.89,50.29 26.16,49.02 27.18,49.02 v27.3,49.15 | v18.54,49.15 TTL.4
  Bottom 0.61: 30.86,17.65 26.42,22.1 23.65,22.1 R-MMC1.1
  Bottom 0.813: IC5.2 33.15,12.19 30.86,14.48 30.86,17.65 31.12,17.91 32.61,17.91 R-33A.2 32.87,18.64 35.43,21.21 36.24,21.21 D2.C 36.62,22.82 C-33VA.+ 35.05,26.41 C-33VB.1
VSS  (via drill 0.9)  (1 unrouted)
  Top 0.305: v36.45,60.07 v32,60.07
  Top 0.406: v17.27,55.12 v26.16,55.12 | v38.99,29.59 v32.13,29.59
  Bottom 0.305: R-LCD.1 16.38,74.17 15.37,73.16 DIS1.1 15.37,71.5 13.85,69.99 13.85,69.47 | R-LCD.1 17.78,74.17 17.91,74.04 17.5,74.04 R-LCD.1 | U1.31 29.9,36.88 | 29.9,36.88 29.97,36.96 30.48,36.96 | 30.48,36.96 30.99,36.96 | 30.99,36.96 31.37,36.96 | 31.37,36.96 31.88,36.96 | 31.88,36.96 32.38,36.96 | 32.38,36.96 32.89,36.96 | 32.89,36.96 33.4,36.96 | 33.4,36.96 33.91,36.96 | 33.91,36.96 34.42,36.96 | 34.42,36.96 34.92,36.96 | 34.92,36.96 35.43,36.96 | 35.43,36.96 35.94,36.96 36.4,36.5 U1.18 | U1.29 30.9,36.87 30.99,36.96 | U1.30 30.4,36.87 30.48,36.96 | U1.28 31.4,36.93 31.37,36.96 | U1.27 31.9,36.94 31.88,36.96 | U1.26 32.4,36.95 32.38,36.96 | 32.89,36.96 32.9,36.95 U1.25 32.9,29.59 32.9,27.06 C-33VB.2 | U1.24 33.4,36.95 33.4,36.96 | U1.23 33.9,36.95 33.91,36.96 | U1.22 34.4,36.94 34.42,36.96 | U1.21 34.9,36.93 34.92,36.96 | U1.20 35.4,36.92 35.43,36.96 | 29.9,36.88 29.9,39.19 29.56,39.52 U1.37 28.67,39.52 28.7,39.5 28.7,40.01 | 28.7,40.01 28.7,40.39 | 28.7,40.39 28.7,40.89 | 28.7,40.89 28.7,43.05 | 28.7,43.05 28.7,43.56 | 28.7,43.56 28.7,44.07 | 28.7,44.07 28.7,44.2 28.37,44.52 | U1.46 28.66,44.02 28.7,44.07 | U1.47 28.37,44.52 | U1.45 28.67,43.52 28.7,43.56 | U1.44 28.67,43.02 28.7,43.05 | U1.40 28.57,41.02 28.7,40.89 | U1.39 28.56,40.52 28.7,40.39 | U1.38 28.68,40.02 28.7,40.01 | U1.50 29.9,45.8 | 29.9,45.8 29.97,45.72 30.23,45.72 | 30.23,45.72 31.88,45.72 | 31.88,45.72 32.38,45.72 | 32.38,45.72 35.31,45.72 | 35.31,45.72 35.81,45.72 | 35.81,45.72 36.2,45.72 36.4,45.92 U1.63 36.4,52.88 35.81,53.47 35.81,59.44 | U1.62 35.9,45.8 35.81,45.72 | U1.61 35.4,45.81 35.31,45.72 | U1.55 32.4,45.73 32.38,45.72 | U1.54 31.9,45.74 31.88,45.72 | 29.9,45.8 29.4,46.3 U1.49 29.4,49.09 TTL.1
  Bottom 0.305: 37.72,41.53 37.72,44.32 37.92,44.52 U1.2 39.95,44.52 40.77,45.34 40.77,54.23 42.29,55.75 50.17,55.75 | 37.72,41.53 37.72,41.15 | 37.72,41.15 37.72,40.64 | 37.72,40.64 37.72,40.13 | 37.72,40.13 37.72,39.88 38.07,39.52 U1.12 45.7,39.52 C-V0.1 48.11,39.12 R-VB0.1 48.13,38.1 48.51,37.72 50.86,37.72 IC2.2 53.59,34.99 53.59,33.15 52.96,32.51 48.64,32.51 48.13,33.02 R-IB0.1 46.12,34.06 C-I0.1 | U1.11 37.83,40.02 37.72,40.13 | U1.10 37.83,40.52 37.72,40.64 | U1.9 37.84,41.02 37.72,41.15 | U1.8 37.72,41.52 37.72,41.53 | L-PWR.C 13.97,49.66 13.33,49.02 13.33,46.99 11.56,45.21 | 11.56,45.21 4.83,45.21 | 4.83,45.21 2.29,45.21 J1.M2 | 11.56,45.21 13.21,43.56 J1.M1 16.13,42.93 15.37,42.16 15.37,33.53 15.88,33.02 | J1.11 19.18,20.7 19.69,20.19 21.72,20.19 21.97,20.45 21.97,25.53 21.21,26.29 18.42,26.29 J1.6 | C-I1.1 48.24,10.8 R-IB1.1 48.26,9.91 49.02,9.14 52.7,9.14 53.97,10.41 53.97,11.62 IC3.2 51.56,14.03 51.56,14.22 51.31,14.48 48.26,14.48 R-VB1.1 | J1.3 16.51,33.66 15.88,33.02 | 15.88,33.02 15.49,32.64 15.49,22.1 16.76,20.83 18.03,20.83 J1.11 | J1.11 J1.10 17.4,19.43 J1.M4 | C-OSCA.2 C-OSCB.2 49.15,50.54 C-OSCB1.2 C-OSCA1.2 50.29,55.88 50.29,68.71 | 50.29,68.71 DIS1.16 64.91,60.45 73.53,60.45 | USB.GND1 3.02,67.97 2.92,68.07 USB.SHIELD2 | USB.GND1 2.95,67.97 2.92,67.94 USB.SHIELD3 | IC1.26 19.05,66.17 18.8,65.91 18.42,65.91 | 18.42,65.91 15.75,65.91 | 15.75,65.91 14.22,65.91 13.85,66.28 IC1.18 13.85,69.47 | IC1.25 18.4,65.92 18.42,65.91 | IC1.21 15.8,65.97 15.75,65.91 | 5.59,51.05 5.59,45.97 4.83,45.21 | USB.GND1 7.02,67.97 8.51,69.47 13.85,69.47 | IC1.7 16.45,55.19 14.61,53.34 7.87,53.34 5.59,51.05
  Bottom 0.305: 5.59,51.05 5.59,62.36 4.95,62.99 2.94,62.99 USB.SHIELD1 | 28.37,44.52 29.03,44.52 30.23,45.72 | 35.81,59.44 35.81,61.21 37.59,62.99 44.57,62.99 50.29,68.71 | 35.81,59.44 v36.45,60.07 | v32,60.07 32,55.24 BOOT.1 | 73.91,51.82 73.91,52.07 PAD-VSS.1 73.53,52.2
  Bottom 0.406: 16.45,55.19 17.2,55.19 v17.27,55.12 | v26.16,55.12 TTL.1 | R-33B.1 32.87,15.52 34.42,13.97 34.42,9.91 35.05,9.27 38.1,9.27 38.99,10.16 | 38.99,10.16 v38.99,29.59 | v32.13,29.59 32.9,29.59 | 38.99,10.16 38.99,8.76 41.27,6.48 51.43,6.48 52.7,7.75 52.7,9.14 | R-VB1.1 46.25,15.9 C-V1.1 | 50.17,55.75 50.29,55.88
  Bottom 0.61: J1.M4 12.95,18.16 12.32,17.53 12.32,11.31 12.06,11.05 | D2.A 32.22,23.58 C-33VA.- | 19.18,11.3 14.86,11.3 IC4.2
  Bottom 0.813: IC4.2 15.37,11.05 12.06,11.05 C-PWR2.2 10.41,10.67 C-PWR1.- 7.37,11.94 PAD-PWR-.1 4.57,15.75 J1.M3 | 19.18,11.3 C-5VA.- 19.82,11.43 C-5VB.2 | C-33VB.2 32.76,24.64 C-33VA.- | USB.SHIELD1 USB.SHIELD3
  Bottom 3.81: 73.91,51.82 81.66,51.82 81.66,51.94 | 74.55,52.58 73.79,52.58 73.79,60.83 81.53,60.83 81.53,60.33 | 73.53,52.2 73.53,60.45